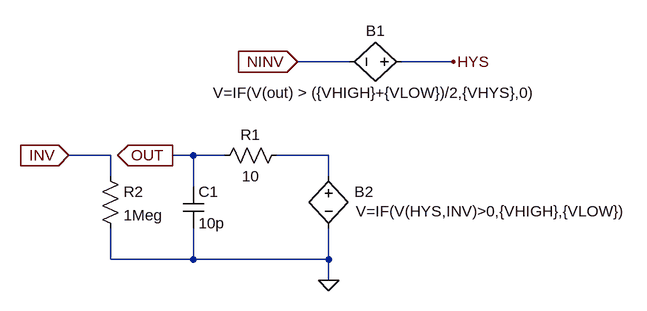
[diagram p0: schematic Ompamp.asc]
Ompamp.asc, the LTspice schematic file:
Version 4
SHEET 1 1152 680
WIRE 672 -144 592 -144
WIRE 832 -144 752 -144
WIRE 304 0 240 0
WIRE 432 0 400 0
WIRE 480 0 432 0
WIRE 640 0 560 0
WIRE 304 32 304 0
WIRE 640 32 640 0
WIRE 432 48 432 0
WIRE 304 160 304 112
WIRE 432 160 432 112
WIRE 432 160 304 160
WIRE 640 160 640 112
WIRE 640 160 432 160
WIRE 640 192 640 160
FLAG 592 -144 NINV
IOPIN 592 -144 In
FLAG 832 -144 HYS
FLAG 640 192 0
FLAG 400 0 OUT
IOPIN 400 0 Out
FLAG 240 0 INV
IOPIN 240 0 In
SYMBOL bv 768 -144 R90
WINDOW 0 -32 56 VBottom 2
WINDOW 3 32 56 VTop 2
SYMATTR InstName B1
SYMATTR Value V=IF(V(out) > ({VHIGH}+{VLOW})/2,{VHYS},0)
SYMBOL bv 640 16 R0
WINDOW 0 40 40 Left 2
WINDOW 3 42 70 Left 2
SYMATTR InstName B2
SYMATTR Value V=IF(V(HYS,INV)>0,{VHIGH},{VLOW})
SYMBOL res 576 -16 R90
WINDOW 0 0 56 VBottom 2
WINDOW 3 32 56 VTop 2
SYMATTR InstName R1
SYMATTR Value 10
SYMBOL cap 416 48 R0
SYMATTR InstName C1
SYMATTR Value 10p
SYMBOL res 288 16 R0
SYMATTR InstName R2
SYMATTR Value 1Meg

The netlist it stands for:
* Ompamp.asc
B1 HYS NINV V=IF(V(out) > ({VHIGH}+{VLOW})/2,{VHYS},0)
B2 N001 0 V=IF(V(HYS,INV)>0,{VHIGH},{VLOW})
R1 N001 OUT 10
C1 OUT 0 10p
R2 INV 0 1Meg
.backanno
.end